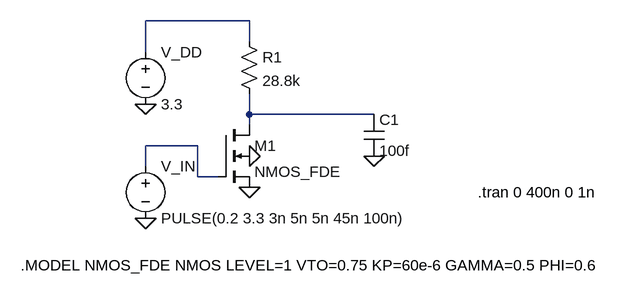
[diagram p0: schematic transitorio.asc]
transitorio.asc, the LTspice schematic file:
Version 4
SHEET 1 1064 680
WIRE 240 16 80 16
WIRE 240 48 240 16
WIRE 80 64 80 16
WIRE 240 160 240 128
WIRE 432 160 240 160
WIRE 240 176 240 160
WIRE 160 208 80 208
WIRE 80 240 80 208
WIRE 160 256 160 208
WIRE 192 256 160 256
FLAG 80 320 0
FLAG 80 144 0
FLAG 240 272 0
FLAG 240 224 0
FLAG 432 224 0
SYMBOL nmos4 192 176 R0
SYMATTR InstName M1
SYMATTR Value NMOS_FDE
SYMATTR Value2 l=1u w=2.22u
SYMBOL voltage 80 48 R0
SYMATTR InstName V_DD
SYMATTR Value 3.3
SYMATTR SpiceLine Rser=0
SYMBOL voltage 80 224 R0
SYMATTR InstName V_IN
SYMATTR Value PULSE(0.2 3.3 3n 5n 5n 45n 100n)
SYMATTR SpiceLine Rser=0
SYMBOL res 224 32 R0
SYMATTR InstName R1
SYMATTR Value 28.8k
SYMBOL cap 416 160 R0
SYMATTR InstName C1
SYMATTR Value 100f
TEXT -112 392 Left 2 !.MODEL NMOS_FDE NMOS LEVEL=1 VTO=0.75 KP=60e-6 GAMMA=0.5 PHI=0.6
TEXT 592 280 Left 2 !.tran 0 400n 0 1n

The netlist it stands for:
* transitorio.asc
M1 N002 N003 0 0 NMOS_FDE l=1u w=2.22u
V_DD N001 0 3.3 Rser=0
V_IN N003 0 PULSE(0.2 3.3 3n 5n 5n 45n 100n) Rser=0
R1 N001 N002 28.8k
C1 N002 0 100f
.model NMOS NMOS
.model PMOS PMOS
.lib standard.mos
.MODEL NMOS_FDE NMOS LEVEL=1 VTO=0.75 KP=60e-6 GAMMA=0.5 PHI=0.6
.tran 0 400n 0 1n
.backanno
.end